# Altium project RobonAUT_main_Project.PrjPcb
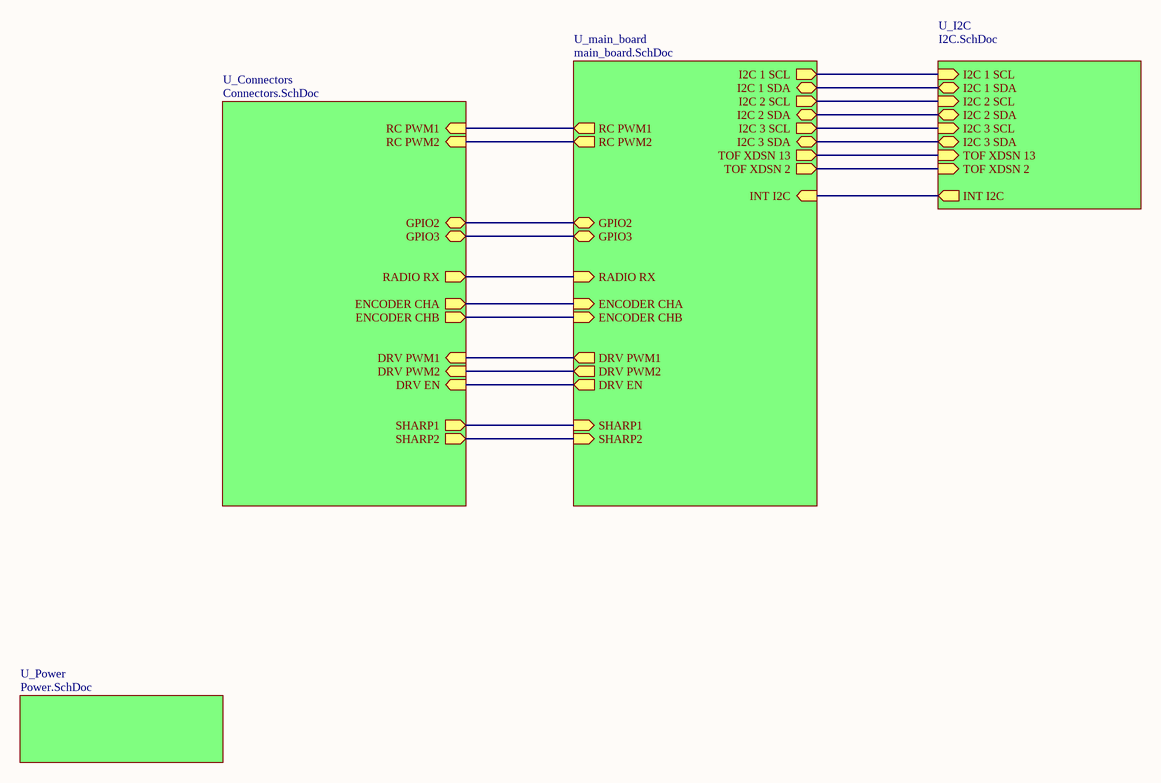
[diagram p0: main_sheet.SchDoc]
5 sheets, 55 parts. Net scope: hierarchical (ports join the sheet entries above them; power ports are global).
Board file: Robonaut_main.PcbDoc
Sheets:
  main_sheet.SchDoc
    U_main_board = main_board.SchDoc
    U_Power = Power.SchDoc
    U_Connectors = Connectors.SchDoc
    U_I2C = I2C.SchDoc

## Sheet main_sheet.SchDoc
size A4

### Sub-sheets
U_Connectors = Connectors.SchDoc: RC PWM1 (in), RC PWM2 (in), ENCODER CHA (out), ENCODER CHB (out), GPIO2 (bidir), GPIO3 (bidir), RADIO RX (out), DRV EN (in), DRV PWM1 (in), DRV PWM2 (in), SHARP1 (out), SHARP2 (out)
U_I2C = I2C.SchDoc: I2C 1 SDA (bidir), I2C 1 SCL (in), TOF XDSN 13 (in), TOF XDSN 2 (in), I2C 2 SDA (bidir), I2C 2 SCL (in), I2C 3 SCL (in), I2C 3 SDA (bidir), INT I2C (out)
U_main_board = main_board.SchDoc: I2C 1 SDA (bidir), I2C 3 SDA (bidir), I2C 1 SCL (out), TOF XDSN 13 (out), TOF XDSN 2 (out), I2C 2 SDA (bidir), I2C 2 SCL (out), I2C 3 SCL (out), RC PWM1 (out), RC PWM2 (out), ENCODER CHA (in), GPIO2 (bidir), GPIO3 (bidir), ENCODER CHB (in), RADIO RX (in), DRV PWM1 (out), DRV PWM2 (out), DRV EN (out), SHARP2 (in), SHARP1 (in), INT I2C (in)
U_Power = Power.SchDoc: no entries

### Nets
INETRIAL_INTERRUPT: sheet U_main_board/INT I2C, sheet U_I2C/INT I2C
NetEncoder_4: sheet U_main_board/ENCODER CHB, sheet U_Connectors/ENCODER CHB
NetEncoder_5: sheet U_main_board/ENCODER CHA, sheet U_Connectors/ENCODER CHA
NetGPIO_4: sheet U_main_board/GPIO3, sheet U_Connectors/GPIO3
NetGPIO_5: sheet U_main_board/GPIO2, sheet U_Connectors/GPIO2
NetInertial_Sensor_20: sheet U_main_board/I2C 3 SCL, sheet U_I2C/I2C 3 SCL
NetInertial_Sensor_21: sheet U_main_board/I2C 3 SDA, sheet U_I2C/I2C 3 SDA
NetMotor_connector_1: sheet U_main_board/DRV EN, sheet U_Connectors/DRV EN
NetMotor_connector_2: sheet U_main_board/DRV PWM1, sheet U_Connectors/DRV PWM1
NetMotor_connector_3: sheet U_main_board/DRV PWM2, sheet U_Connectors/DRV PWM2
NetR6_1: sheet U_main_board/I2C 1 SCL, sheet U_I2C/I2C 1 SCL
NetR7_1: sheet U_main_board/I2C 1 SDA, sheet U_I2C/I2C 1 SDA
NetR8_1: sheet U_main_board/I2C 2 SCL, sheet U_I2C/I2C 2 SCL
NetR10_2: sheet U_main_board/I2C 2 SDA, sheet U_I2C/I2C 2 SDA
NetR12_1: sheet U_main_board/SHARP1, sheet U_Connectors/SHARP1
NetR13_1: sheet U_main_board/SHARP2, sheet U_Connectors/SHARP2
NetRadio_12: sheet U_main_board/RADIO RX, sheet U_Connectors/RADIO RX
NetSFRONT_1: sheet U_main_board/RC PWM2, sheet U_Connectors/RC PWM2
NetSREAR_1: sheet U_main_board/RC PWM1, sheet U_Connectors/RC PWM1
NetToF1_3: sheet U_main_board/TOF XDSN 13, sheet U_I2C/TOF XDSN 13
NetToF2_3: sheet U_main_board/TOF XDSN 2, sheet U_I2C/TOF XDSN 2

## Sheet main_board.SchDoc
size A4
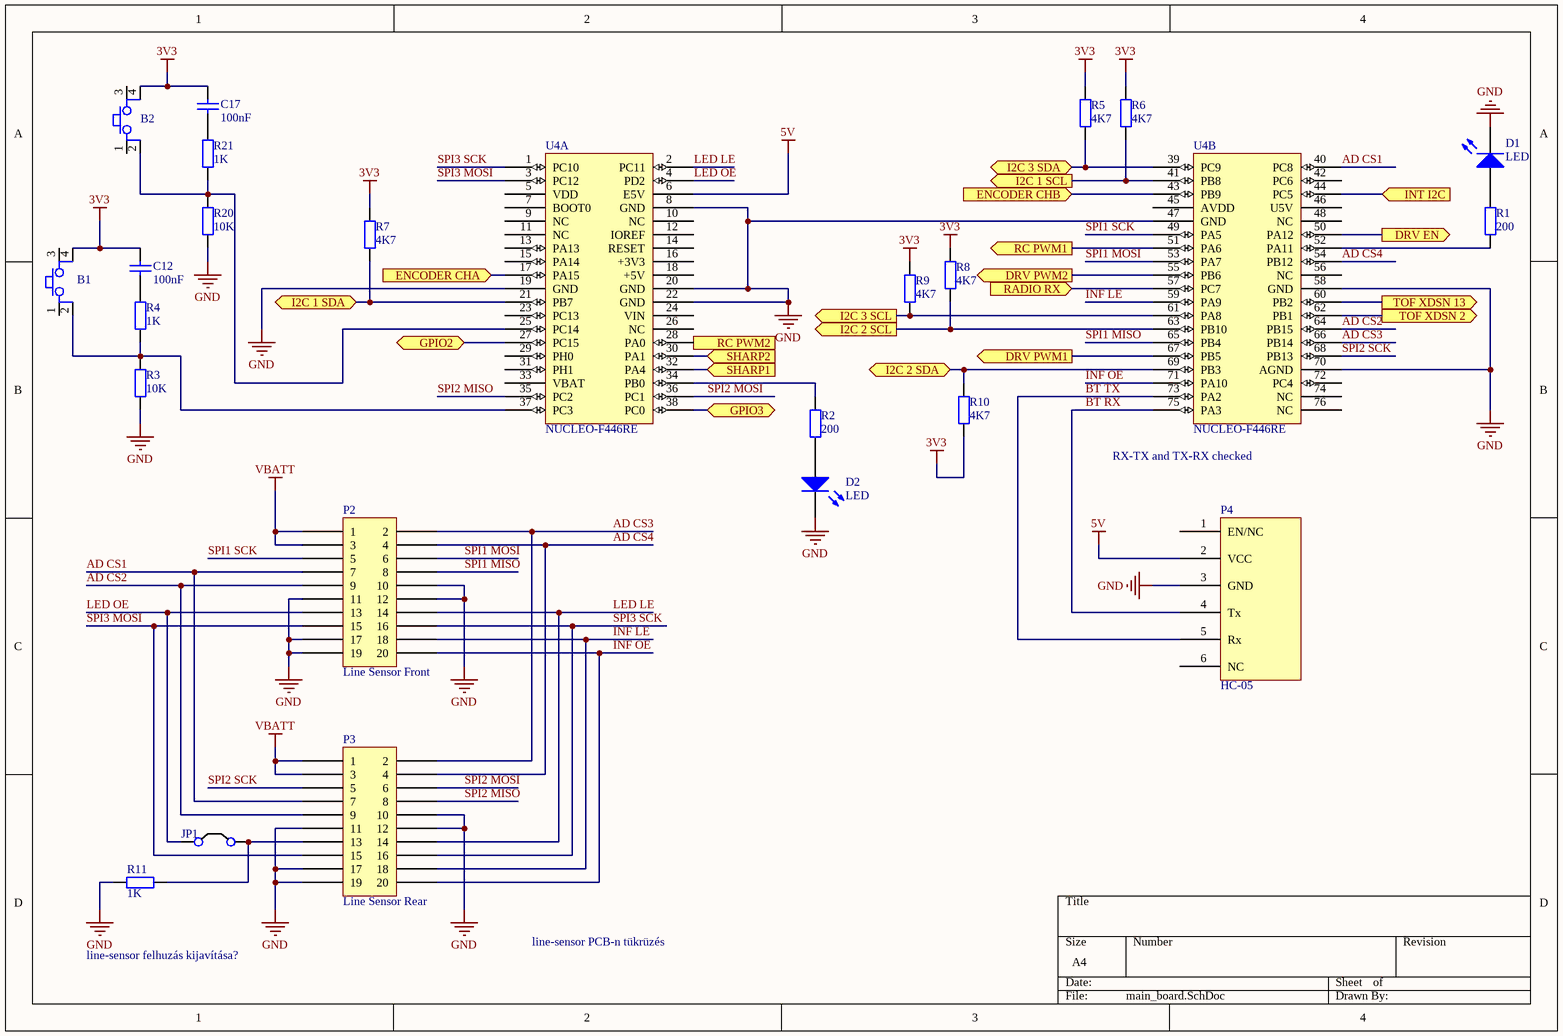
[diagram p1: main_board.SchDoc]

### Parts
B1  Button  [FP_BTN_SMD]  (value not drawn)
B2  Button  [FP_BTN_SMD]  (value not drawn)
C12  100nF  [FP_0805_CAP_085]
C17  100nF  [FP_0805_CAP_085]
D1  LED  [FP_0805_LED_RED]
D2  LED  [FP_0805_LED_RED]
JP1  JUMPER  [FP_CONN2_TUSKE_254MM]  (value not drawn)
P2  Line Sensor Front  [FP_CONN20PINS_LOMEX]
P3  Line Sensor Rear  [FP_CONN20PINS_LOMEX]
P4  HC-05  [FP_CONN6_TAP_254MM]
R1  200  [FP_0805_RES]
R2  200  [FP_0805_RES]
R3  10K  [FP_0805_RES]
R4  1K  [FP_0805_RES]
R5  4K7  [FP_1206_RES]
R6  4K7  [FP_1206_RES]
R7  4K7  [FP_1206_RES]
R8  4K7  [FP_1206_RES]
R9  4K7  [FP_1206_RES]
R10  4K7  [FP_1206_RES]
R11  1K  [FP_0805_RES]
R20  10K  [FP_0805_RES]
R21  1K  [FP_0805_RES]
U4  NUCLEO-F446RE  [FP_NUCLEO-64_2x20]  (parts A,B of 2)

### Ports
DRV EN (out), DRV PWM1 (out), DRV PWM2 (out), ENCODER CHA (in), ENCODER CHB (in), GPIO2 (bidir), GPIO3 (bidir), I2C 1 SCL (out), I2C 1 SDA (bidir), I2C 2 SCL (out), I2C 2 SDA (bidir), I2C 3 SCL (out), I2C 3 SDA (bidir), INT I2C (in), RADIO RX (in), RC PWM1 (out), RC PWM2 (out), SHARP1 (in), SHARP2 (in), TOF XDSN 2 (out), TOF XDSN 13 (out)

### Nets
3V3: B1.4 B2.4 C12.2 C17.2 R5.2 R6.2 R7.2 R8.2 R9.2 R10.1
5V: P4.2(VCC) U4.6(E5V)
GND: D1.2(K) D2.2(K) P2.10 P2.11 P2.12 P2.17 P2.19 P3.10 P3.11 P3.12 P3.17 P3.19 P4.3(GND) R3.1 R11.2 R20.1 U4.8(GND) U4.19(GND) U4.20(GND) U4.22(GND) U4.47(GND) U4.58(GND) U4.70(AGND)
VBATT: P2.1 P2.3 P3.1 P3.3
AD CS1: P2.7 P3.7 U4.40(PC8)
AD CS2: P2.9 P3.9 U4.64(PB15)
AD CS3: P2.2 P3.2 U4.66(PB14)
AD CS4: P2.4 P3.4 U4.54(PB12)
BT RX: P4.4(Tx) U4.75(PA3)
BT TX: P4.5(Rx) U4.73(PA2)
INETRIAL_INTERRUPT: U4.44(PC5) ; port INT I2C
INF LE: P2.18 P3.18 U4.59(PA9)
INF OE: P2.20 P3.20 U4.71(PA10)
LED LE: P2.14 P3.14 U4.2(PC11)
LED OE: JP1.1(C1) P2.13 U4.4(PD2)
SPI1 MISO: P2.8 U4.65(PB4)
SPI1 MOSI: P2.6 U4.53(PA7)
SPI1 SCK: P2.5 U4.49(PA5)
SPI2 MISO: P3.8 U4.35(PC2)
SPI2 MOSI: P3.6 U4.36(PC1)
SPI2 SCK: P3.5 U4.68(PB13)
SPI3 MOSI: P2.15 P3.15 U4.3(PC12)
SPI3 SCK: P2.16 P3.16 U4.1(PC10)
NetB1_2: B1.2 R3.2 R4.1 U4.37(PC3)
NetB2_2: B2.2 R20.2 R21.1 U4.25(PC14)
NetC12_1: C12.1 R4.2
NetC17_1: C17.1 R21.2
NetD1_1: D1.1(A) R1.1
NetD2_1: D2.1(A) R2.1
NetEncoder_4: U4.43(PB9) ; port ENCODER CHB
NetEncoder_5: U4.17(PA15) ; port ENCODER CHA
NetGPIO_4: U4.38(PC0) ; port GPIO3
NetGPIO_5: U4.27(PC15) ; port GPIO2
NetInertial_Sensor_20: R9.1 U4.61(PA8) ; port I2C 3 SCL
NetInertial_Sensor_21: R5.1 U4.39(PC9) ; port I2C 3 SDA
NetJP1_2: JP1.2(C2) P3.13 R11.1
NetMotor_connector_1: U4.50(PA12) ; port DRV EN
NetMotor_connector_2: U4.67(PB5) ; port DRV PWM1
NetMotor_connector_3: U4.55(PB6) ; port DRV PWM2
NetR1_2: R1.2 U4.52(PA11)
NetR2_2: R2.2 U4.34(PB0)
NetR6_1: R6.1 U4.41(PB8) ; port I2C 1 SCL
NetR7_1: R7.1 U4.21(PB7) ; port I2C 1 SDA
NetR8_1: R8.1 U4.63(PB10) ; port I2C 2 SCL
NetR10_2: R10.2 U4.69(PB3) ; port I2C 2 SDA
NetR12_1: U4.32(PA4) ; port SHARP1
NetR13_1: U4.30(PA1) ; port SHARP2
NetRadio_12: U4.57(PC7) ; port RADIO RX
NetSFRONT_1: U4.28(PA0) ; port RC PWM2
NetSREAR_1: U4.51(PA6) ; port RC PWM1
NetToF1_3: U4.60(PB2) ; port TOF XDSN 13
NetToF2_3: U4.62(PB1) ; port TOF XDSN 2

Not connected (* = marked no-connect by the designer): B1 1 3; B2 1 3; P4 1(EN/NC) 6(NC); U4 5(VDD) 7(BOOT0) 9(NC) 10(NC) 11(NC) 12(IOREF) 13(PA13) 14(RESET) 15(PA14) 16(+3V3) 18(+5V) 23(PC13) 24(VIN) 26(NC) 29(PH0) 31(PH1) 33(VBAT) 42(PC6) 45(AVDD) 46(U5V) 48(NC) 56(NC) 72(PC4) 74(NC) 76(NC)

### Notes on the sheet
- (near U4) RX-TX and TX-RX checked
- line-sensor felhuzás kijavítása?
- line-sensor PCB-n tükrüzés

### Library data of the parts
B1 B2 = Button 4P: Push button; Reference: https://hu.mouser.com/ProductDetail/TE-Connectivity-Alcoswitch/FSM2JSMAATR?qs=g%252BEszo6zu8MKdISiZRITCQ%3D%3D; Supplier: Mouser
C12 C17 = CAP: Capacitor; Supplier: Farnell; Reference: https://hu.farnell.com/yageo/cc1206krx7r8bb104/cap-0-1-f-25v-10-x7r-1206/dp/644316?st=capacitor%20smd; Value: 100nF
D1 D2 = LED: Typical RED GaAs LED; pin to pad: 1>A 2>K
JP1 = JUMPER_CONN: Jumper Wire (Connected)
P2 P3 = 302-S201: Conn Shrouded Header HDR 20 POS 2.54mm Solder ST Thru-Hole; Manufacturer: On-Shore Technology; Number of Positions: 20; Connector Type: Male Pin; Pitch: 0.1inch; Supplier 1: Digi-Key; Manufacturer Part Number: 302-S201; RoHS: Yes; Category: Headers and Wire Housings; Stock 1: 299353; Pricing 1: 1=0,48000, 10=0,40700, 160=0,31675, 480=0,27148, 960=0,22624, 4960=0,19392, 10080=0,18099 (USD); Mount: Through Hole; Color: Black; Contact Plating: Gold; Number of Rows: 2; Packaging: Tray; Termination: Solder; Series: 302; Contact Type: Male Pin; Row Spacing: 0.1inch; RoHS Compliant: Yes; ComponentLink1URL: https://datasheet.ciiva.com/742/302-sxxx-742190.pdf?src-supplier=Digi-Key; ComponentLink1Description: https://datasheet.ciiva.com/742/302-sxxx-742190.pdf?src-supplier=Digi-Key
R1-R11 R20 R21 = RES: Resistor
  R1 R2: Value: 200
  R3 R20: Supplier: Farnell; Reference: https://hu.farnell.com/multicomp/mcmr12x1002ftl/res-10k-1-0-25w-1206-ceramic/dp/2073878; Value: 10K
  R4 R21: Supplier: Farnell; Reference: https://hu.farnell.com/te-connectivity/crgh1206j1k0/res-1k-5-0-5w-1206-thick-film/dp/2331865; Value: 1K
  R5-R10: Supplier: Farnell; Reference: https://hu.farnell.com/yageo/rc1206fr-074k7l/res-4k7-1-0-25w-1206-thick-film/dp/9240985; Value: 4K7
  R11: Value: 1K
U4 = NUCLEO-F446RE: Reference: NUCLEO; Name: Nucleo F446RE; Supplier: Tanszék

## Sheet Power.SchDoc
size A4
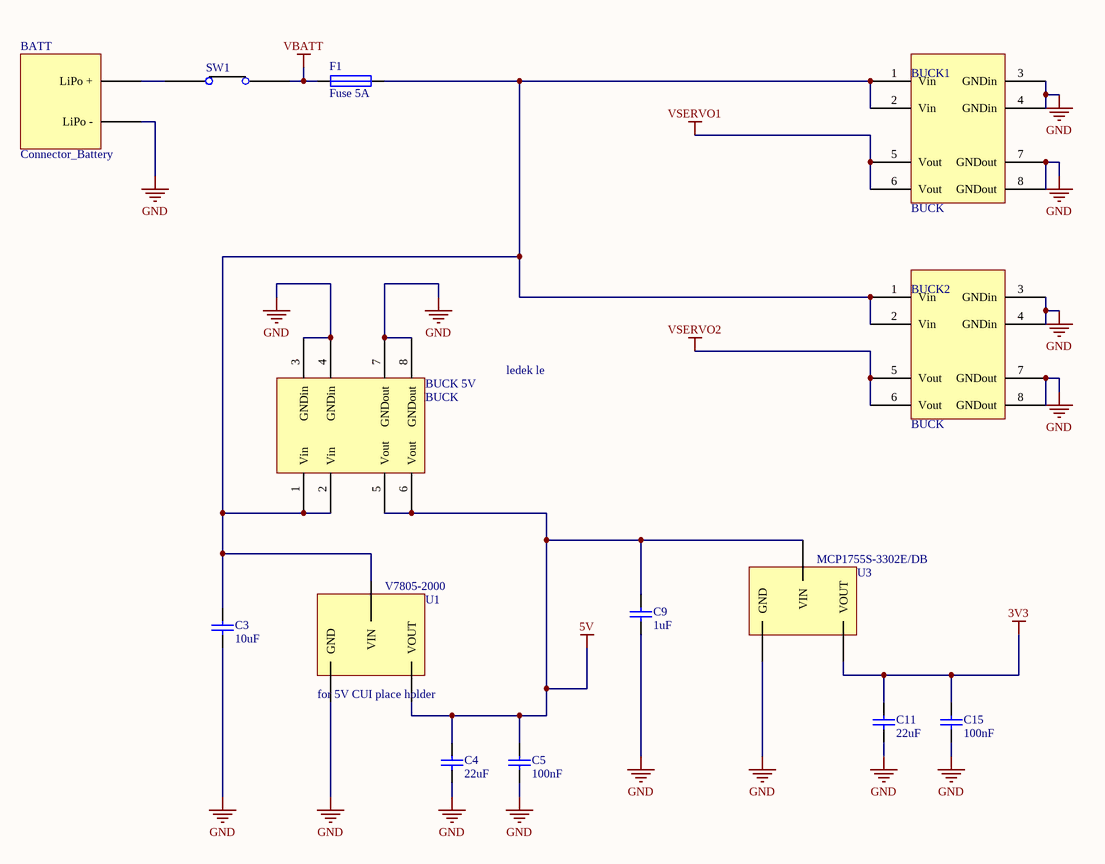
[diagram p2: Power.SchDoc]

### Parts
BATT  Connector_Battery  [CONN_BATT_LiPo_]
BUCK1  BUCK  [BUCK]
BUCK2  BUCK  [BUCK]
BUCK_5V  BUCK  [BUCK]
C3  10uF  [FP_1210_CAP]
C4  22uF  [FP_1210_CAP]
C5  100nF  [FP_1206_CAP_125]
C9  1uF  [FP_1206_CAP_125]
C11  22uF  [FP_1210_CAP]
C15  100nF  [FP_1206_CAP_125]
F1  Fuse 5A  [PTF/16_Fuse_holder]
SW1  Main  [FP_SWITCH_4.8x0.8]  (value not drawn)
U1  V7805-2000  [V7805-2000_Buck]
U3  MCP1755S-3302E/DB  [MCP1755S-3302E/DB_LDO]

### Nets
3V3: C11.2 C15.2 U3.3(VOUT)
5V: BUCK_5V.5(Vout) BUCK_5V.6(Vout) C4.2 C5.2 C9.2 U1.3(VOUT) U3.1(VIN)
GND: BATT.2(LiPo_-) BUCK1.3(GNDin) BUCK1.4(GNDin) BUCK1.7(GNDout) BUCK1.8(GNDout) BUCK2.3(GNDin) BUCK2.4(GNDin) BUCK2.7(GNDout) BUCK2.8(GNDout) BUCK_5V.3(GNDin) BUCK_5V.4(GNDin) BUCK_5V.7(GNDout) BUCK_5V.8(GNDout) C3.1 C4.1 C5.1 C9.1 C11.1 C15.1 U1.2(GND) U3.2(GND)
VBATT: F1.1 SW1.2
VSERVO1: BUCK1.5(Vout) BUCK1.6(Vout)
VSERVO2: BUCK2.5(Vout) BUCK2.6(Vout)
NetBATT_1: BATT.1(LiPo_+) SW1.1
NetBUCK1_1: BUCK1.1(Vin) BUCK1.2(Vin) BUCK2.1(Vin) BUCK2.2(Vin) BUCK_5V.1(Vin) BUCK_5V.2(Vin) C3.2 F1.2 U1.1(VIN)

### Notes on the sheet
- ledek le
- (near U1) for 5V CUI place holder

### Library data of the parts
C3-C5 C9 C11 C15 = CAP: Capacitor
  C3: Supplier: Farnell; Reference: https://hu.farnell.com/kemet/c1210c106k3ractu/cap-10-f-25v-10-x7r-1210/dp/1358512; Value: 10uF
  C4 C11: Supplier: Farnell; Reference: https://hu.farnell.com/kemet/c1210c226k4ractu/cap-22-f-16v-10-x7r-1210/dp/2456343; Value: 22uF; ComponentLink1Description: Supplier; ComponentLink1URL: https://hu.farnell.com/kemet/c1210c226k4ractu/cap-22-f-16v-10-x7r-1210/dp/2456343
  C5 C15: Value: 100nF; ComponentLink1Description: Supplier; ComponentLink1URL: https://hu.farnell.com/yageo/cc1206krx7r8bb104/cap-0-1-f-25v-10-x7r-1206/dp/644316?st=capacitor%20smd
  C9: Supplier: Farnell; Reference: https://hu.farnell.com/multicomp/mcsh31b105k100ct/cap-1-f-10v-10-x7r-1206/dp/1856632; Value: 1uF; ComponentLink1Description: Supplier; ComponentLink1URL: https://hu.farnell.com/multicomp/mcsh31b105k100ct/cap-1-f-10v-10-x7r-1206/dp/1856632
F1 = Fuse
SW1 = SWITCH
U1 = V7805-2000: Module DC-DC 12VIN 1-OUT 5V 2A 10W 3-Pin SIP Module; Manufacturer: CUI; Number of Outputs: 1; Efficiency: 91%; Min Input Voltage: 7V; Max Input Voltage: 18V; Isolation: Non-Isolated; Supplier 1: Digi-Key; Manufacturer Part Number: V7805-2000; RoHS: Yes; Category: Board Mount Modules; Stock 1: 11968; Pricing 1: 1=9,75000, 5=9,67800, 10=9,60400, 25=9,45600, 44=9,16045, 88=8,27398, 264=8,12625, 440=7,97850 (USD); Mount: Through Hole; Case/Package: SIP; Min Operating Temperature: -40°C; Max Operating Temperature: 85°C; Output Power: 10W; Output Voltage: 5V; Package Quantity: 44; Packaging: Rail/Tube; Voltage - Output 1: 5V; Max Output Current: 2A; Max Power Dissipation: 10W; Features: OTP,SCP; Series: V78-2000; Current - Output 1: 2A; Length: 0.45inch; Width: 0.35inch; Height: 0.69inch; Lead Free: Lead Free; RoHS Compliant: Yes; ComponentLink1URL: http://www.mouser.com/ds/2/670/v78-2000-520517.pdf?src-supplier=Mouser; ComponentLink1Description: http://www.mouser.com/ds/2/670/v78-2000-520517.pdf?src-supplier=Mouser; ComponentLink2URL: https://www.cui.com/product/resource/digikeypdf/v78xx-2000.pdf?src-supplier=Digi-Key; ComponentLink2Description: https://www.cui.com/product/resource/digikeypdf/v78xx-2000.pdf?src-supplier=Digi-Key; ComponentLink3URL: http://www.cui.com/Product/Resource/FuturePDF/V78-2000.pdf?src-supplier=Future+Electronics; ComponentLink3Description: http://www.cui.com/Product/Resource/FuturePDF/V78-2000.pdf?src-supplier=Future+Electronics; Supplier Part Number 1: 102-2175-ND
U3 = MCP1755S-3302E/DB: LDO Regulator Pos 3.3V 0.3A 3-Pin SOT-223; Manufacturer: Microchip; Output Current: 300mA; Dropout Voltage: 300mV; Max Input Voltage: 16V; Min Input Voltage: 3.6V; Number of Outputs: 1; Tolerance: 2%; Quiescent Current: 100uA; Polarity: Positive; Power Supply Rejection Ratio (PSRR): 80dB; Nominal Supply Current: 68uA; Output Type: Fixed; Supplier 1: RSComponents; Manufacturer Part Number: MCP1755S-3302E/DB; RoHS: Yes; Category: Voltage Regulators - Linear; Stock 1: 1; Pricing 1: 10=0,94200 (USD); Mount: Surface Mount; Case/Package: SOT-223-3; Number of Pins: 3; Weight: 0.008826oz; Min Operating Temperature: -40°C; Max Operating Temperature: 125°C; Nominal Output Voltage: 3.3V; Output Voltage: 3.3V; Packaging: Bulk; Package Quantity: 78; Max Output Current: 300mA; Accuracy: 2%; Series: MCP1755; Supply Current: 68uA; Length: 6.7mm; Width: 3.7mm; Height: 1.7mm; REACH SVHC: No SVHC; Lead Free: Lead Free; RoHS Compliant: Yes; ComponentLink1URL: https://datasheet.ciiva.com/48506/mcp1755s-eng-tds-48506837.pdf?src-supplier=Distrelec; ComponentLink1Description: https://datasheet.ciiva.com/48506/mcp1755s-eng-tds-48506837.pdf?src-supplier=Distrelec; ComponentLink2URL: https://datasheet.ciiva.com/22748/1697992-22748101.pdf?src-supplier=Element14; ComponentLink2Description: https://datasheet.ciiva.com/22748/1697992-22748101.pdf?src-supplier=Element14; ComponentLink3URL: https://datasheet.ciiva.com/24137/25160a-238586-24137546.pdf?src-supplier=Mouser; ComponentLink3Description: https://datasheet.ciiva.com/24137/25160a-238586-24137546.pdf?src-supplier=Mouser; Supplier Part Number 1: 7990389

## Sheet Connectors.SchDoc
size A4
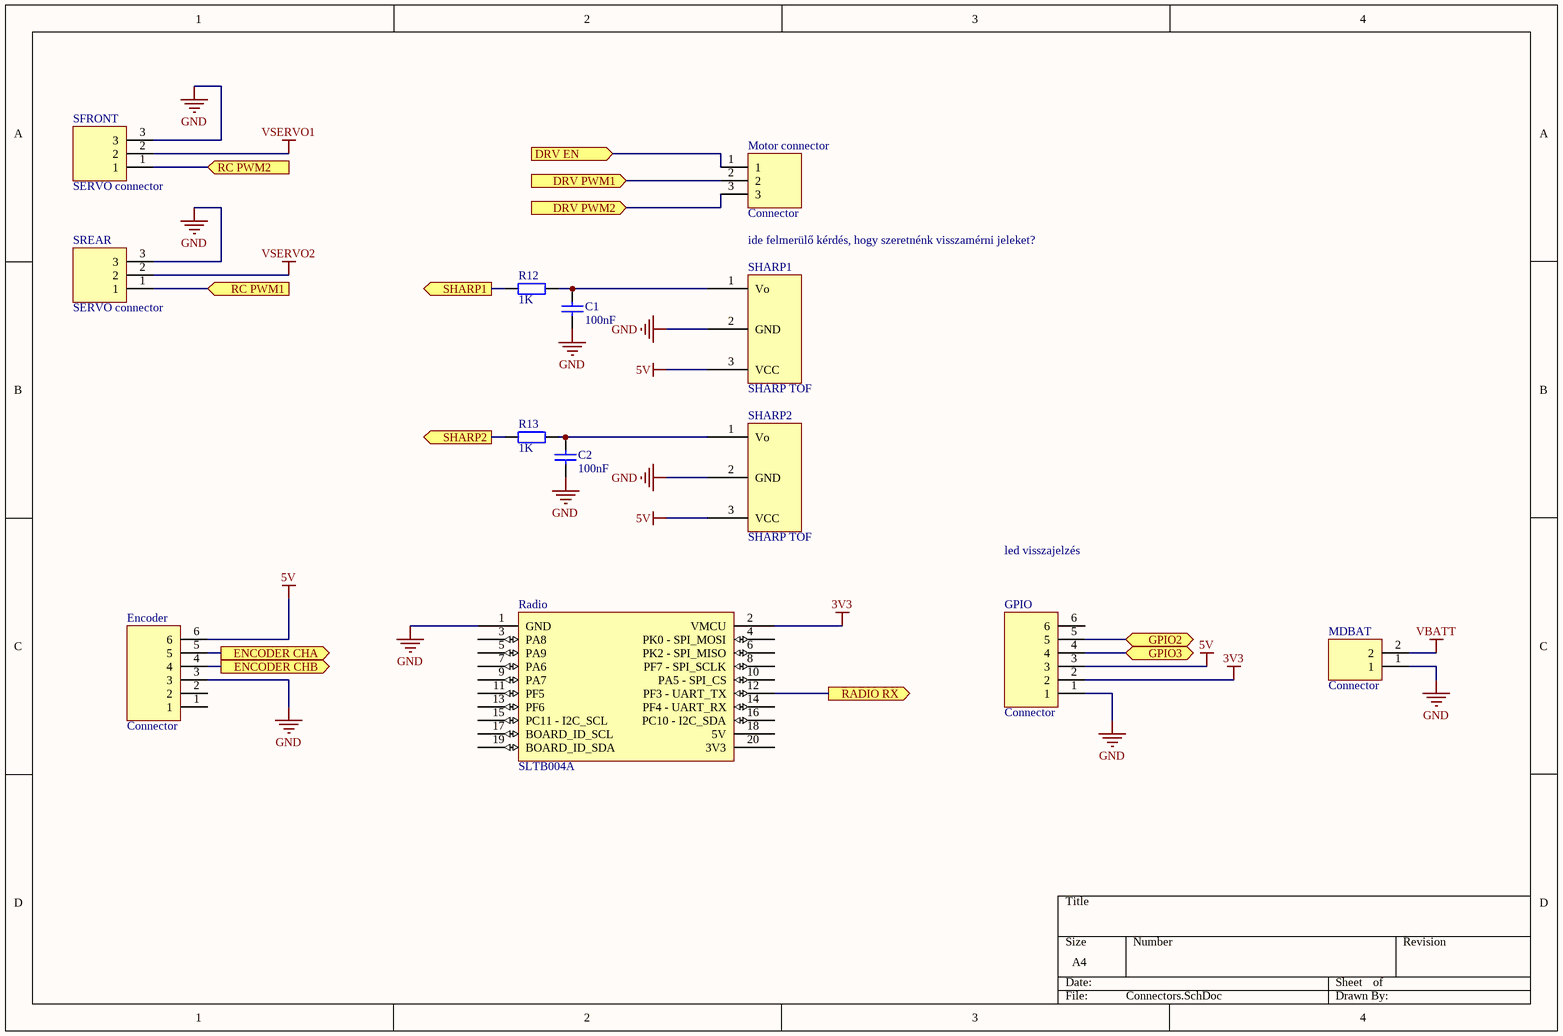
[diagram p3: Connectors.SchDoc]

### Parts
C1  100nF  [FP_0805_CAP_085]
C2  100nF  [FP_0805_CAP_085]
Encoder  Connector  [FP_CONN6PIN_2X3_254]
GPIO  Connector  [FP_CONN6PIN_2X3_254]
MDBAT  Connector  [CONN_2pin]
Motor_connector  Connector  [sorkapocs 3 pin]
R12  1K  [FP_0805_RES]
R13  1K  [FP_0805_RES]
Radio  SLTB004A  [SLTB004A]
SFRONT  SERVO connector  [RC_SERVO_CONN]
SHARP1  SHARP TOF  [SHARP TOF]
SHARP2  SHARP TOF  [SHARP TOF]
SREAR  SERVO connector  [RC_SERVO_CONN]

### Ports
DRV EN (in), DRV PWM1 (in), DRV PWM2 (in), ENCODER CHA (out), ENCODER CHB (out), GPIO2 (bidir), GPIO3 (bidir), RADIO RX (out), RC PWM1 (in), RC PWM2 (in), SHARP1 (out), SHARP2 (out)

### Nets
3V3: GPIO.2 Radio.2(VMCU)
5V: Encoder.6 GPIO.3 SHARP1.3(VCC) SHARP2.3(VCC)
GND: C1.1 C2.1 Encoder.3 GPIO.1 MDBAT.1 Radio.1(GND) SFRONT.3 SHARP1.2(GND) SHARP2.2(GND) SREAR.3
VBATT: MDBAT.2
VSERVO1: SFRONT.2
VSERVO2: SREAR.2
NetC1_2: C1.2 R12.2 SHARP1.1(Vo)
NetC2_2: C2.2 R13.2 SHARP2.1(Vo)
NetEncoder_4: Encoder.4 ; port ENCODER CHB
NetEncoder_5: Encoder.5 ; port ENCODER CHA
NetGPIO_4: GPIO.4 ; port GPIO3
NetGPIO_5: GPIO.5 ; port GPIO2
NetMotor_connector_1: Motor_connector.1 ; port DRV EN
NetMotor_connector_2: Motor_connector.2 ; port DRV PWM1
NetMotor_connector_3: Motor_connector.3 ; port DRV PWM2
NetR12_1: R12.1 ; port SHARP1
NetR13_1: R13.1 ; port SHARP2
NetRadio_12: Radio.12(PF3_-_UART_TX) ; port RADIO RX
NetSFRONT_1: SFRONT.1 ; port RC PWM2
NetSREAR_1: SREAR.1 ; port RC PWM1

Not connected (* = marked no-connect by the designer): Encoder 1 2; GPIO 6; Radio 3(PA8) 4(PK0_-_SPI_MOSI) 5(PA9) 6(PK2_-_SPI_MISO) 7(PA6) 8(PF7_-_SPI_SCLK) 9(PA7) 10(PA5_-_SPI_CS) 11(PF5) 13(PF6) 14(PF4_-_UART_RX) 15(PC11_-_I2C_SCL) 16(PC10_-_I2C_SDA) 17(BOARD_ID_SCL) 18(5V) 19(BOARD_ID_SDA) 20(3V3)

### Notes on the sheet
- ide felmerülő kérdés, hogy szeretnénk visszamérni jeleket?
- led visszajelzés

### Library data of the parts
C1 C2 = CAP: Capacitor; Value: 100nF
Encoder GPIO = Connector_6pin: 6pin connector
MDBAT = Connector_2pin: 2pin connector
Motor_connector SFRONT SREAR = Connector_3pin: 3pin connector
R12 R13 = RES: Resistor; Value: 1K
Radio = SLTB004A: SiLabs Thunderboard Sense 2 module

## Sheet I2C.SchDoc
size A4
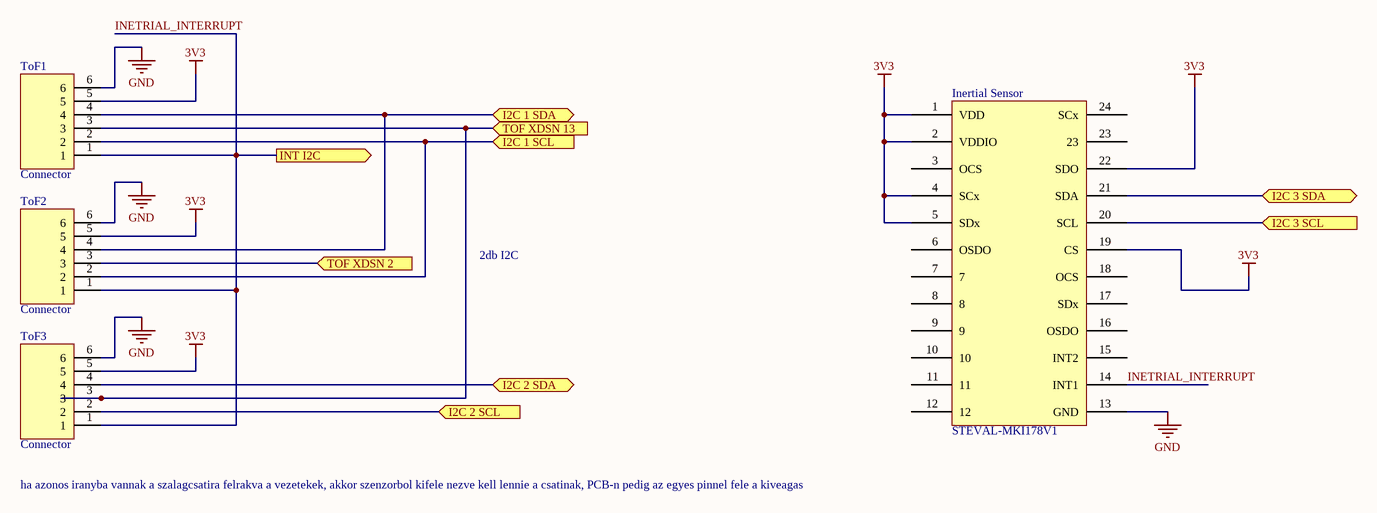
[diagram p4: I2C.SchDoc]

### Parts
Inertial_Sensor  STEVAL-MKI178V1  [STEVAL-MKI178V1]
ToF1  Connector  [FP_CONN6PIN_2X3_254]
ToF2  Connector  [FP_CONN6PIN_2X3_254]
ToF3  Connector  [FP_CONN6PIN_2X3_254]

### Ports
I2C 1 SCL (in), I2C 1 SDA (bidir), I2C 2 SCL (in), I2C 2 SDA (bidir), I2C 3 SCL (in), I2C 3 SDA (bidir), INT I2C (out), TOF XDSN 2 (in), TOF XDSN 13 (in)

### Nets
3V3: Inertial_Sensor.1(VDD) Inertial_Sensor.2(VDDIO) Inertial_Sensor.4(SCx) Inertial_Sensor.5(SDx) Inertial_Sensor.19(CS) Inertial_Sensor.22(SDO) ToF1.5 ToF2.5 ToF3.5
GND: Inertial_Sensor.13(GND) ToF1.6 ToF2.6 ToF3.6
INETRIAL_INTERRUPT: Inertial_Sensor.14(INT1) ToF1.1 ToF2.1 ToF3.1 ; port INT I2C
NetInertial_Sensor_20: Inertial_Sensor.20(SCL) ; port I2C 3 SCL
NetInertial_Sensor_21: Inertial_Sensor.21(SDA) ; port I2C 3 SDA
NetR6_1: ToF1.2 ToF2.2 ; port I2C 1 SCL
NetR7_1: ToF1.4 ToF2.4 ; port I2C 1 SDA
NetR8_1: ToF3.2 ; port I2C 2 SCL
NetR10_2: ToF3.4 ; port I2C 2 SDA
NetToF1_3: ToF1.3 ToF3.3 ; port TOF XDSN 13
NetToF2_3: ToF2.3 ; port TOF XDSN 2

Not connected (* = marked no-connect by the designer): Inertial_Sensor 3(OCS) 6(OSDO) 7 8 9 10 11 12 15(INT2) 16(OSDO) 17(SDx) 18(OCS) 23 24(SCx)

### Notes on the sheet
- 2db I2C
- ha azonos iranyba vannak a szalagcsatira felrakva a vezetekek, akkor szenzorbol kifele nezve kell lennie a csatinak, PCB-n pedig az egyes pinnel fele a kiveagas

### Library data of the parts
ToF1-ToF3 = Connector_6pin: 6pin connector

## Nets that join several sheets
3V3: main_board (10 pins), Power (C11.2 C15.2 U3.3), Connectors (GPIO.2 Radio.2), I2C (9 pins)
5V: main_board (P4.2 U4.6), Power (7 pins), Connectors (Encoder.6 GPIO.3 SHARP1.3 SHARP2.3)
GND: main_board (23 pins), Power (21 pins), Connectors (10 pins), I2C (Inertial_Sensor.13 ToF1.6 ToF2.6 ToF3.6)
VBATT: main_board (P2.1 P2.3 P3.1 P3.3), Power (F1.1 SW1.2), Connectors (MDBAT.2)
VSERVO1: Power (BUCK1.5 BUCK1.6), Connectors (SFRONT.2)
VSERVO2: Power (BUCK2.5 BUCK2.6), Connectors (SREAR.2)
INETRIAL_INTERRUPT: main_board (U4.44), I2C (Inertial_Sensor.14 ToF1.1 ToF2.1 ToF3.1)
NetEncoder_4: main_board (U4.43), Connectors (Encoder.4)
NetEncoder_5: main_board (U4.17), Connectors (Encoder.5)
NetGPIO_4: main_board (U4.38), Connectors (GPIO.4)
NetGPIO_5: main_board (U4.27), Connectors (GPIO.5)
NetInertial_Sensor_20: main_board (R9.1 U4.61), I2C (Inertial_Sensor.20)
NetInertial_Sensor_21: main_board (R5.1 U4.39), I2C (Inertial_Sensor.21)
NetMotor_connector_1: main_board (U4.50), Connectors (Motor_connector.1)
NetMotor_connector_2: main_board (U4.67), Connectors (Motor_connector.2)
NetMotor_connector_3: main_board (U4.55), Connectors (Motor_connector.3)
NetR6_1: main_board (R6.1 U4.41), I2C (ToF1.2 ToF2.2)
NetR7_1: main_board (R7.1 U4.21), I2C (ToF1.4 ToF2.4)
NetR8_1: main_board (R8.1 U4.63), I2C (ToF3.2)
NetR10_2: main_board (R10.2 U4.69), I2C (ToF3.4)
NetR12_1: main_board (U4.32), Connectors (R12.1)
NetR13_1: main_board (U4.30), Connectors (R13.1)
NetRadio_12: main_board (U4.57), Connectors (Radio.12)
NetSFRONT_1: main_board (U4.28), Connectors (SFRONT.1)
NetSREAR_1: main_board (U4.51), Connectors (SREAR.1)
NetToF1_3: main_board (U4.60), I2C (ToF1.3 ToF3.3)
NetToF2_3: main_board (U4.62), I2C (ToF2.3)